# EAGLE schematic motor-board (EAGLE 7.7.0)
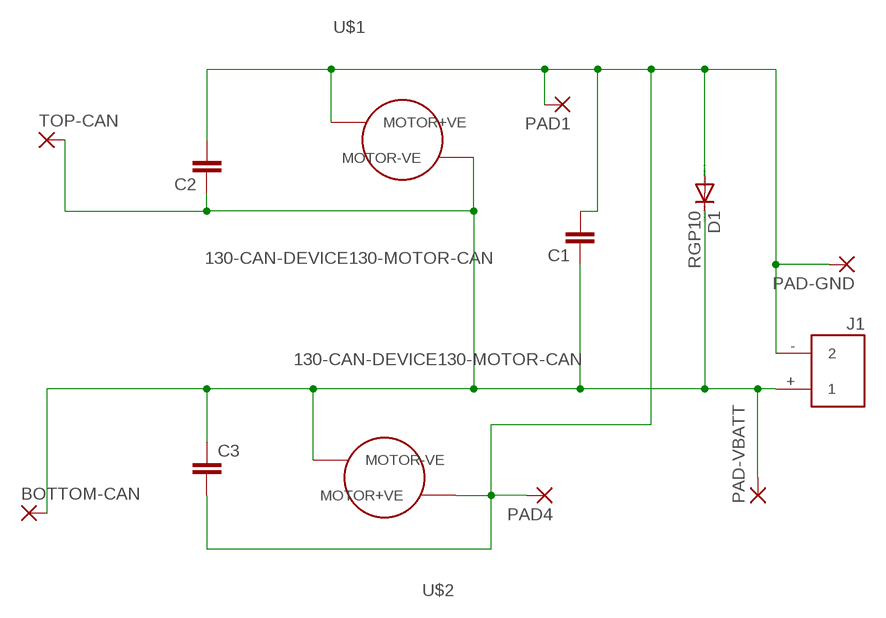
[diagram p0: schematic, sheet 1]

## Parts
BOTTOM-CAN  WIREPADSMD1,27-254  [SMD1,27-2,54]
C1  C-EU050-024X044  [C050-024X044]
C2  C-EU050-024X044  [C050-024X044]
C3  C-EU050-024X044  [C050-024X044]
D1  RGP10  [DO41-10]
J1  XT60_FEMALE  [XT60_FEMALE]
PAD1  WIREPADSMD1,27-254  [SMD1,27-2,54]
PAD4  WIREPADSMD1,27-254  [SMD1,27-2,54]
PAD-GND  WIREPAD3,81/1,4  [3,81/1,4]
PAD-VBATT  WIREPAD3,81/1,4  [3,81/1,4]
TOP-CAN  WIREPADSMD1,27-254  [SMD1,27-2,54]
U$1  130-CAN-DEVICE130-MOTOR-CAN  [130-MOTOR-CAN]
U$2  130-CAN-DEVICE130-MOTOR-CAN  [130-MOTOR-CAN]

## Nets
GND: C1.2 C2.2 C3.2 D1.A J1.- PAD1.1(P) PAD4.1(P) PAD-GND.1(P) U$1.MOTOR+VE U$2.MOTOR+VE
VBATT: BOTTOM-CAN.1(P) C1.1 C2.1 C3.1 D1.C J1.+ PAD-VBATT.1(P) TOP-CAN.1(P) U$1.MOTOR-VE U$2.MOTOR-VE

## Library data of the parts
BOTTOM-CAN PAD1 PAD4 PAD-GND PAD-VBATT TOP-CAN = wirepad:WIREPAD: Wire PAD connect wire on PCB
C1-C3 = resistor:C-EU: CAPACITOR, European symbol
D1 = diode:RGP10: DIODE fast-recovery rectifier
J1 = Tristan+Robitaille's+Library:XT60_FEMALE: Vertical Mount Through-Hole Female (receptacle) XT60 Connector
U$1 U$2 = 130-can:130-CAN-DEVICE